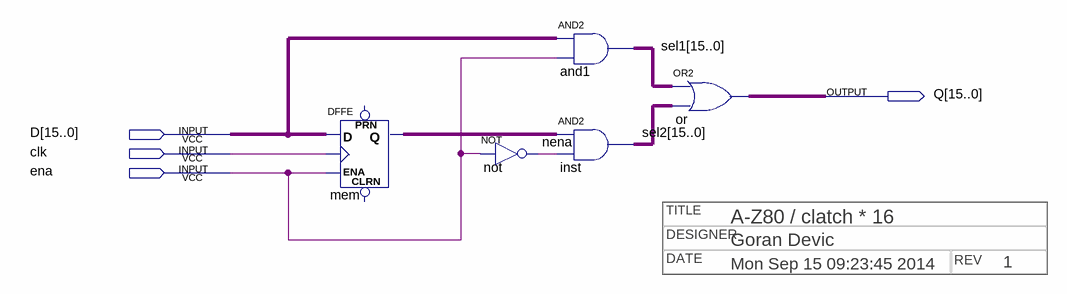
[diagram p0: schematic sheet]
// Quartus schematic clatch16.bdf as structural Verilog: 5 symbols, 4 pins
// Title block: TITLE: A-Z80 / clatch * 16; DESIGNER: Goran Devic; DATE: Mon Sep 15 09:23:45 2014; REV: 1
module clatch16 (
  input  [15:0] D,
  input  clk,
  input  ena,
  output [15:0] Q
);

  wire nena;
  wire [15:0] mem_q, sel1, sel2;

  DFFE mem[15:0] (.D(D), .CLK(clk), .ENA(ena), .Q(mem_q));  // open: PRN, CLRN
  not \not  (nena, ena);
  assign sel1 = D & {16{ena}};  // AND2 and1, 16 bits wide
  assign sel2 = mem_q & {16{nena}};  // AND2 inst, 16 bits wide
  assign Q = sel1 | sel2;  // OR2 or, 16 bits wide
endmodule
